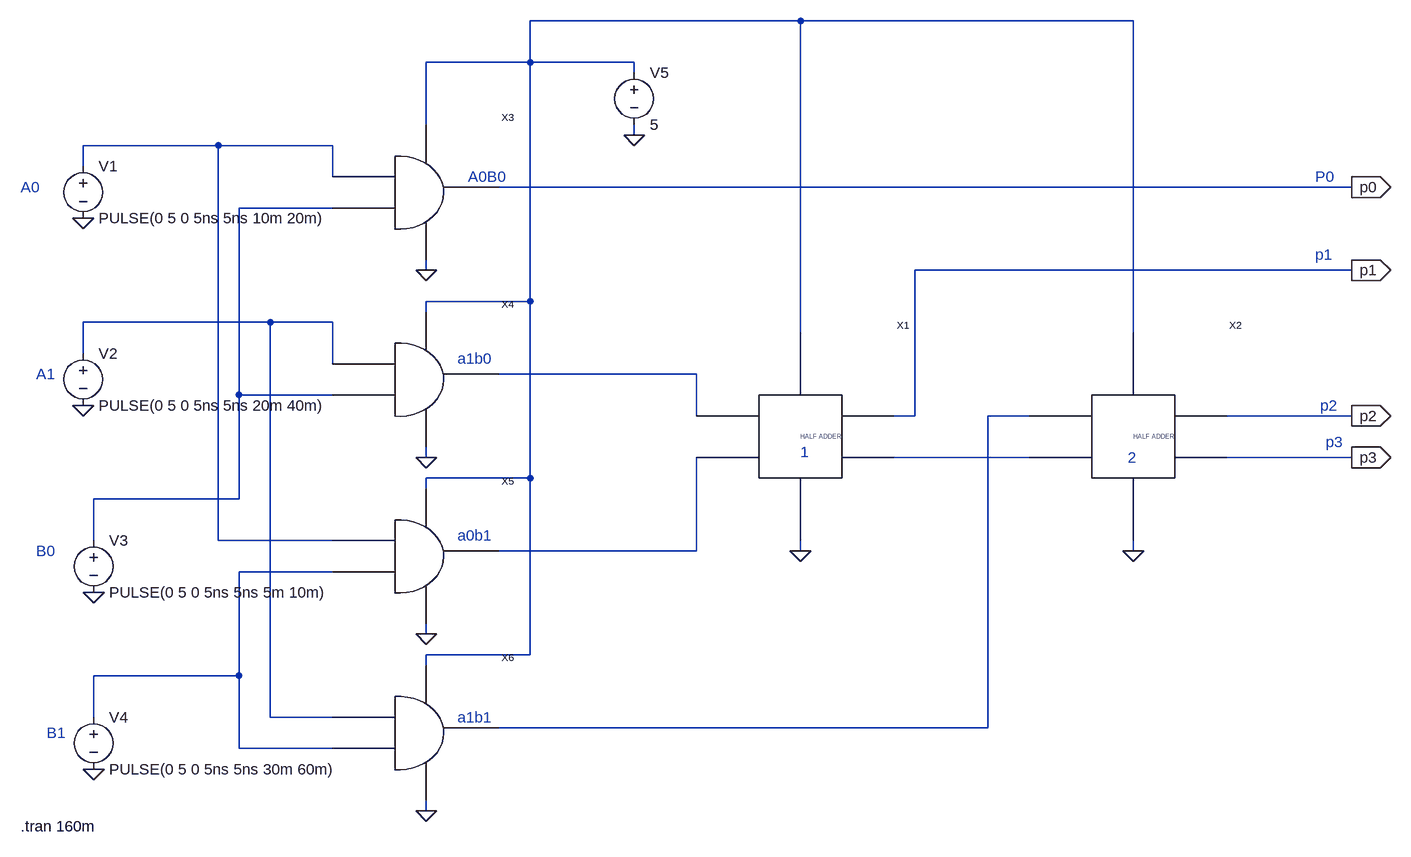
[diagram p0: schematic multiplier2bit.asc]
multiplier2bit.asc, the LTspice schematic file:
Version 4
SHEET 1 880 808
WIRE -144 -448 -560 -448
WIRE 368 -448 -144 -448
WIRE -560 -384 -560 -448
WIRE -560 -384 -720 -384
WIRE -400 -384 -560 -384
WIRE -400 -368 -400 -384
WIRE -720 -288 -720 -384
WIRE -400 -272 -400 -288
WIRE -1040 -256 -1248 -256
WIRE -864 -256 -1040 -256
WIRE -1248 -224 -1248 -256
WIRE -864 -208 -864 -256
WIRE 704 -192 -608 -192
WIRE -864 -160 -1008 -160
WIRE -720 -64 -720 -80
WIRE 704 -64 32 -64
WIRE -560 -16 -560 -384
WIRE -560 -16 -720 -16
WIRE -720 0 -720 -16
WIRE -960 16 -1248 16
WIRE -864 16 -960 16
WIRE -144 32 -144 -448
WIRE 368 32 368 -448
WIRE -1248 64 -1248 16
WIRE -864 80 -864 16
WIRE -304 96 -608 96
WIRE -1008 128 -1008 -160
WIRE -864 128 -1008 128
WIRE -304 160 -304 96
WIRE 32 160 32 -64
WIRE 32 160 0 160
WIRE 208 160 144 160
WIRE 704 160 512 160
WIRE -720 224 -720 208
WIRE 208 224 0 224
WIRE 704 224 512 224
WIRE -560 256 -560 -16
WIRE -560 256 -720 256
WIRE -720 272 -720 256
WIRE -1008 288 -1008 128
WIRE -1008 288 -1232 288
WIRE -1232 352 -1232 288
WIRE -1040 352 -1040 -256
WIRE -864 352 -1040 352
WIRE -304 368 -304 224
WIRE -304 368 -608 368
WIRE -144 368 -144 352
WIRE 368 368 368 352
WIRE -864 400 -1008 400
WIRE -720 496 -720 480
WIRE -560 528 -560 256
WIRE -560 528 -720 528
WIRE -720 544 -720 528
WIRE -1008 560 -1008 400
WIRE -1008 560 -1232 560
WIRE -1232 624 -1232 560
WIRE -960 624 -960 16
WIRE -864 624 -960 624
WIRE 144 640 144 160
WIRE 144 640 -608 640
WIRE -1008 672 -1008 560
WIRE -864 672 -1008 672
WIRE -720 768 -720 752
FLAG -720 -64 0
FLAG -720 224 0
FLAG -720 496 0
FLAG -720 768 0
FLAG -400 -272 0
FLAG -144 368 0
FLAG 368 368 0
FLAG -1248 -144 0
FLAG -1248 144 0
FLAG -1232 432 0
FLAG -1232 704 0
FLAG 704 -192 p0
IOPIN 704 -192 Out
FLAG 704 -64 p1
IOPIN 704 -64 Out
FLAG 704 160 p2
IOPIN 704 160 Out
FLAG 704 224 p3
IOPIN 704 224 Out
SYMBOL halfadderimply -160 192 R0
SYMATTR InstName X1
SYMBOL halfadderimply 352 192 R0
SYMATTR InstName X2
SYMBOL andgateimply -832 -192 R0
SYMATTR InstName X3
SYMBOL andgateimply -832 96 R0
SYMATTR InstName X4
SYMBOL andgateimply -832 368 R0
SYMATTR InstName X5
SYMBOL andgateimply -832 640 R0
SYMATTR InstName X6
SYMBOL voltage -1248 -240 R0
WINDOW 123 0 0 Left 0
WINDOW 39 0 0 Left 0
SYMATTR InstName V1
SYMATTR Value PULSE(0 5 0 5ns 5ns 10m 20m)
SYMBOL voltage -1248 48 R0
WINDOW 123 0 0 Left 0
WINDOW 39 0 0 Left 0
SYMATTR InstName V2
SYMATTR Value PULSE(0 5 0 5ns 5ns 20m 40m)
SYMBOL voltage -1232 336 R0
WINDOW 123 0 0 Left 0
WINDOW 39 0 0 Left 0
SYMATTR InstName V3
SYMATTR Value PULSE(0 5 0 5ns 5ns 5m 10m)
SYMBOL voltage -1232 608 R0
WINDOW 123 0 0 Left 0
WINDOW 39 0 0 Left 0
SYMATTR InstName V4
SYMATTR Value PULSE(0 5 0 5ns 5ns 30m 60m)
SYMBOL voltage -400 -384 R0
WINDOW 123 0 0 Left 0
WINDOW 39 0 0 Left 0
SYMATTR InstName V5
SYMATTR Value 5
TEXT -1344 -192 Left 2 ;A0
TEXT -1320 96 Left 2 ;A1
TEXT -1320 368 Left 2 ;B0
TEXT -1304 648 Left 2 ;B1
TEXT -144 216 Left 2 ;1
TEXT 360 224 Left 2 ;2
TEXT 648 -208 Left 2 ;P0
TEXT -656 -208 Left 2 ;A0B0
TEXT -672 72 Left 2 ;a1b0
TEXT -672 344 Left 2 ;a0b1
TEXT -672 624 Left 2 ;a1b1
TEXT 648 -88 Left 2 ;p1
TEXT 656 144 Left 2 ;p2
TEXT 664 200 Left 2 ;p3
TEXT -1344 792 Left 2 !.tran 160m

The netlist it stands for:
* multiplier2bit.asc
XX1 N005 N008 N001 0 p1 N007 halfadderimply  ; pins A B VDD VSS SUM COUT
XX2 N006 N007 N001 0 p2 p3 halfadderimply  ; pins A B VDD VSS SUM COUT
XX3 N001 0 N002 N003 p0 andgateimply  ; pins VDD VSS A B OUT
XX4 N001 0 N004 N003 N005 andgateimply  ; pins VDD VSS A B OUT
XX5 N001 0 N002 N009 N008 andgateimply  ; pins VDD VSS A B OUT
XX6 N001 0 N004 N009 N006 andgateimply  ; pins VDD VSS A B OUT
V1 N002 0 PULSE(0 5 0 5ns 5ns 10m 20m)
V2 N004 0 PULSE(0 5 0 5ns 5ns 20m 40m)
V3 N003 0 PULSE(0 5 0 5ns 5ns 5m 10m)
V4 N009 0 PULSE(0 5 0 5ns 5ns 30m 60m)
V5 N001 0 5
* A0
* A1
* B0
* B1
* 1
* 2
* P0
* A0B0
* a1b0
* a0b1
* a1b1
* p1
* p2
* p3
.tran 160m
.backanno
.end